# Altium schematic sheet Resistors.SchDoc
size Letter; DrawnBy: Adam Gilbert; Organization: Altium Limited; Address1: L3, 12a Rodborough Rd; Address2: Frenchs Forest; Address3: NSW; Address4: Australia 2086; DocumentNumber: 4; SheetNumber: 4; SheetTotal: 4
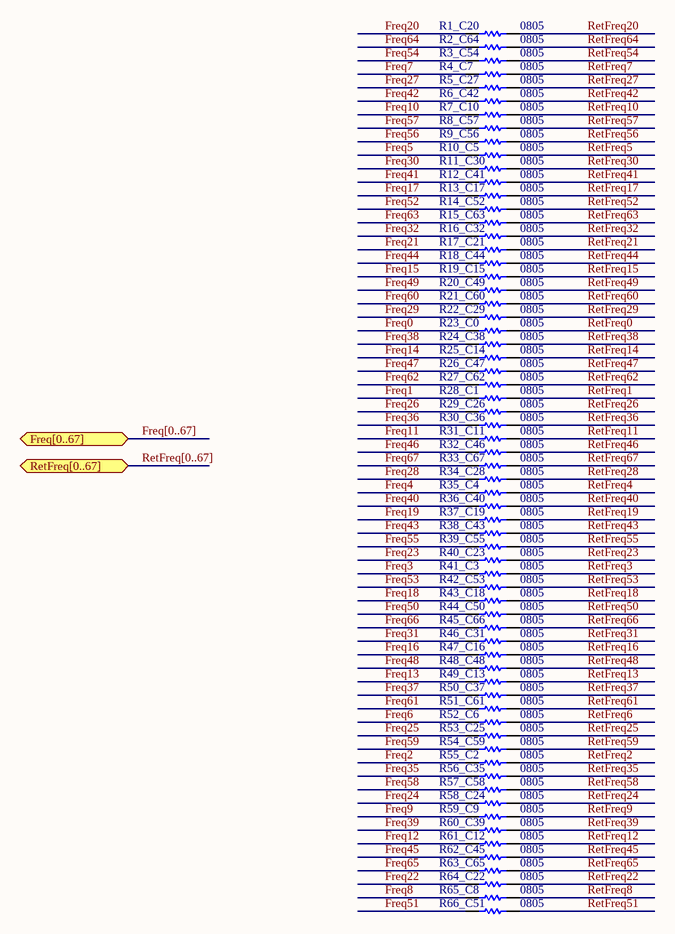
[diagram p0: Resistors.SchDoc]

## Parts
R1_C20  Res0805  [0805]  (value not drawn)
R2_C64  Res0805  [0805]  (value not drawn)
R3_C54  Res0805  [0805]  (value not drawn)
R4_C7  Res0805  [0805]  (value not drawn)
R5_C27  Res0805  [0805]  (value not drawn)
R6_C42  Res0805  [0805]  (value not drawn)
R7_C10  Res0805  [0805]  (value not drawn)
R8_C57  Res0805  [0805]  (value not drawn)
R9_C56  Res0805  [0805]  (value not drawn)
R10_C5  Res0805  [0805]  (value not drawn)
R11_C30  Res0805  [0805]  (value not drawn)
R12_C41  Res0805  [0805]  (value not drawn)
R13_C17  Res0805  [0805]  (value not drawn)
R14_C52  Res0805  [0805]  (value not drawn)
R15_C63  Res0805  [0805]  (value not drawn)
R16_C32  Res0805  [0805]  (value not drawn)
R17_C21  Res0805  [0805]  (value not drawn)
R18_C44  Res0805  [0805]  (value not drawn)
R19_C15  Res0805  [0805]  (value not drawn)
R20_C49  Res0805  [0805]  (value not drawn)
R21_C60  Res0805  [0805]  (value not drawn)
R22_C29  Res0805  [0805]  (value not drawn)
R23_C0  Res0805  [0805]  (value not drawn)
R24_C38  Res0805  [0805]  (value not drawn)
R25_C14  Res0805  [0805]  (value not drawn)
R26_C47  Res0805  [0805]  (value not drawn)
R27_C62  Res0805  [0805]  (value not drawn)
R28_C1  Res0805  [0805]  (value not drawn)
R29_C26  Res0805  [0805]  (value not drawn)
R30_C36  Res0805  [0805]  (value not drawn)
R31_C11  Res0805  [0805]  (value not drawn)
R32_C46  Res0805  [0805]  (value not drawn)
R33_C67  Res0805  [0805]  (value not drawn)
R34_C28  Res0805  [0805]  (value not drawn)
R35_C4  Res0805  [0805]  (value not drawn)
R36_C40  Res0805  [0805]  (value not drawn)
R37_C19  Res0805  [0805]  (value not drawn)
R38_C43  Res0805  [0805]  (value not drawn)
R39_C55  Res0805  [0805]  (value not drawn)
R40_C23  Res0805  [0805]  (value not drawn)
R41_C3  Res0805  [0805]  (value not drawn)
R42_C53  Res0805  [0805]  (value not drawn)
R43_C18  Res0805  [0805]  (value not drawn)
R44_C50  Res0805  [0805]  (value not drawn)
R45_C66  Res0805  [0805]  (value not drawn)
R46_C31  Res0805  [0805]  (value not drawn)
R47_C16  Res0805  [0805]  (value not drawn)
R48_C48  Res0805  [0805]  (value not drawn)
R49_C13  Res0805  [0805]  (value not drawn)
R50_C37  Res0805  [0805]  (value not drawn)
R51_C61  Res0805  [0805]  (value not drawn)
R52_C6  Res0805  [0805]  (value not drawn)
R53_C25  Res0805  [0805]  (value not drawn)
R54_C59  Res0805  [0805]  (value not drawn)
R55_C2  Res0805  [0805]  (value not drawn)
R56_C35  Res0805  [0805]  (value not drawn)
R57_C58  Res0805  [0805]  (value not drawn)
R58_C24  Res0805  [0805]  (value not drawn)
R59_C9  Res0805  [0805]  (value not drawn)
R60_C39  Res0805  [0805]  (value not drawn)
R61_C12  Res0805  [0805]  (value not drawn)
R62_C45  Res0805  [0805]  (value not drawn)
R63_C65  Res0805  [0805]  (value not drawn)
R64_C22  Res0805  [0805]  (value not drawn)
R65_C8  Res0805  [0805]  (value not drawn)
R66_C51  Res0805  [0805]  (value not drawn)

## Ports
Freq[0..67], RetFreq[0..67]

## Nets
Freq0: R23_C0.1
Freq1: R28_C1.1
Freq2: R55_C2.1
Freq3: R41_C3.1
Freq4: R35_C4.1
Freq5: R10_C5.1
Freq6: R52_C6.1
Freq7: R4_C7.1
Freq8: R65_C8.1
Freq9: R59_C9.1
Freq10: R7_C10.1
Freq11: R31_C11.1
Freq12: R61_C12.1
Freq13: R49_C13.1
Freq14: R25_C14.1
Freq15: R19_C15.1
Freq16: R47_C16.1
Freq17: R13_C17.1
Freq18: R43_C18.1
Freq19: R37_C19.1
Freq20: R1_C20.1
Freq21: R17_C21.1
Freq22: R64_C22.1
Freq23: R40_C23.1
Freq24: R58_C24.1
Freq25: R53_C25.1
Freq26: R29_C26.1
Freq27: R5_C27.1
Freq28: R34_C28.1
Freq29: R22_C29.1
Freq30: R11_C30.1
Freq31: R46_C31.1
Freq32: R16_C32.1
Freq35: R56_C35.1
Freq36: R30_C36.1
Freq37: R50_C37.1
Freq38: R24_C38.1
Freq39: R60_C39.1
Freq40: R36_C40.1
Freq41: R12_C41.1
Freq42: R6_C42.1
Freq43: R38_C43.1
Freq44: R18_C44.1
Freq45: R62_C45.1
Freq46: R32_C46.1
Freq47: R26_C47.1
Freq48: R48_C48.1
Freq49: R20_C49.1
Freq50: R44_C50.1
Freq51: R66_C51.1
Freq52: R14_C52.1
Freq53: R42_C53.1
Freq54: R3_C54.1
Freq55: R39_C55.1
Freq56: R9_C56.1
Freq57: R8_C57.1
Freq58: R57_C58.1
Freq59: R54_C59.1
Freq60: R21_C60.1
Freq61: R51_C61.1
Freq62: R27_C62.1
Freq63: R15_C63.1
Freq64: R2_C64.1
Freq65: R63_C65.1
Freq66: R45_C66.1
Freq67: R33_C67.1
RetFreq0: R23_C0.2
RetFreq1: R28_C1.2
RetFreq2: R55_C2.2
RetFreq3: R41_C3.2
RetFreq4: R35_C4.2
RetFreq5: R10_C5.2
RetFreq6: R52_C6.2
RetFreq7: R4_C7.2
RetFreq8: R65_C8.2
RetFreq9: R59_C9.2
RetFreq10: R7_C10.2
RetFreq11: R31_C11.2
RetFreq12: R61_C12.2
RetFreq13: R49_C13.2
RetFreq14: R25_C14.2
RetFreq15: R19_C15.2
RetFreq16: R47_C16.2
RetFreq17: R13_C17.2
RetFreq18: R43_C18.2
RetFreq19: R37_C19.2
RetFreq20: R1_C20.2
RetFreq21: R17_C21.2
RetFreq22: R64_C22.2
RetFreq23: R40_C23.2
RetFreq24: R58_C24.2
RetFreq25: R53_C25.2
RetFreq26: R29_C26.2
RetFreq27: R5_C27.2
RetFreq28: R34_C28.2
RetFreq29: R22_C29.2
RetFreq30: R11_C30.2
RetFreq31: R46_C31.2
RetFreq32: R16_C32.2
RetFreq35: R56_C35.2
RetFreq36: R30_C36.2
RetFreq37: R50_C37.2
RetFreq38: R24_C38.2
RetFreq39: R60_C39.2
RetFreq40: R36_C40.2
RetFreq41: R12_C41.2
RetFreq42: R6_C42.2
RetFreq43: R38_C43.2
RetFreq44: R18_C44.2
RetFreq45: R62_C45.2
RetFreq46: R32_C46.2
RetFreq47: R26_C47.2
RetFreq48: R48_C48.2
RetFreq49: R20_C49.2
RetFreq50: R44_C50.2
RetFreq51: R66_C51.2
RetFreq52: R14_C52.2
RetFreq53: R42_C53.2
RetFreq54: R3_C54.2
RetFreq55: R39_C55.2
RetFreq56: R9_C56.2
RetFreq57: R8_C57.2
RetFreq58: R57_C58.2
RetFreq59: R54_C59.2
RetFreq60: R21_C60.2
RetFreq61: R51_C61.2
RetFreq62: R27_C62.2
RetFreq63: R15_C63.2
RetFreq64: R2_C64.2
RetFreq65: R63_C65.2
RetFreq66: R45_C66.2
RetFreq67: R33_C67.2

## Buses and harness runs
bus Freq[0..67] = port Freq[0..67]
bus RetFreq[0..67] = port RetFreq[0..67]

## Notes on the sheet
- Title
- Size:
- Date:
- Letter
- Number:
- Time:
- Revision:
- Sheet
- of
- Cosmology
- File:

## Library data of the parts
R1_C20 R2_C64 R3_C54 R4_C7 R5_C27 R6_C42 R7_C10 R8_C57 R9_C56 R10_C5 R11_C30 R12_C41 R13_C17 R14_C52 R15_C63 R16_C32 R17_C21 R18_C44 R19_C15 R20_C49 R21_C60 R22_C29 R23_C0 R24_C38 R25_C14 R26_C47 R27_C62 R28_C1 R29_C26 R30_C36 R31_C11 R32_C46 R33_C67 R34_C28 R35_C4 R36_C40 R37_C19 R38_C43 R39_C55 R40_C23 R41_C3 R42_C53 R43_C18 R44_C50 R45_C66 R46_C31 R47_C16 R48_C48 R49_C13 R50_C37 R51_C61 R52_C6 R53_C25 R54_C59 R55_C2 R56_C35 R57_C58 R58_C24 R59_C9 R60_C39 R61_C12 R62_C45 R63_C65 R64_C22 R65_C8 R66_C51 = Res0805: Resistor; Param1: 100ppm/C; Param: 1%; TechInfo: *; Value: Value